# EAGLE design audiodaq_b (EAGLE 6.4)
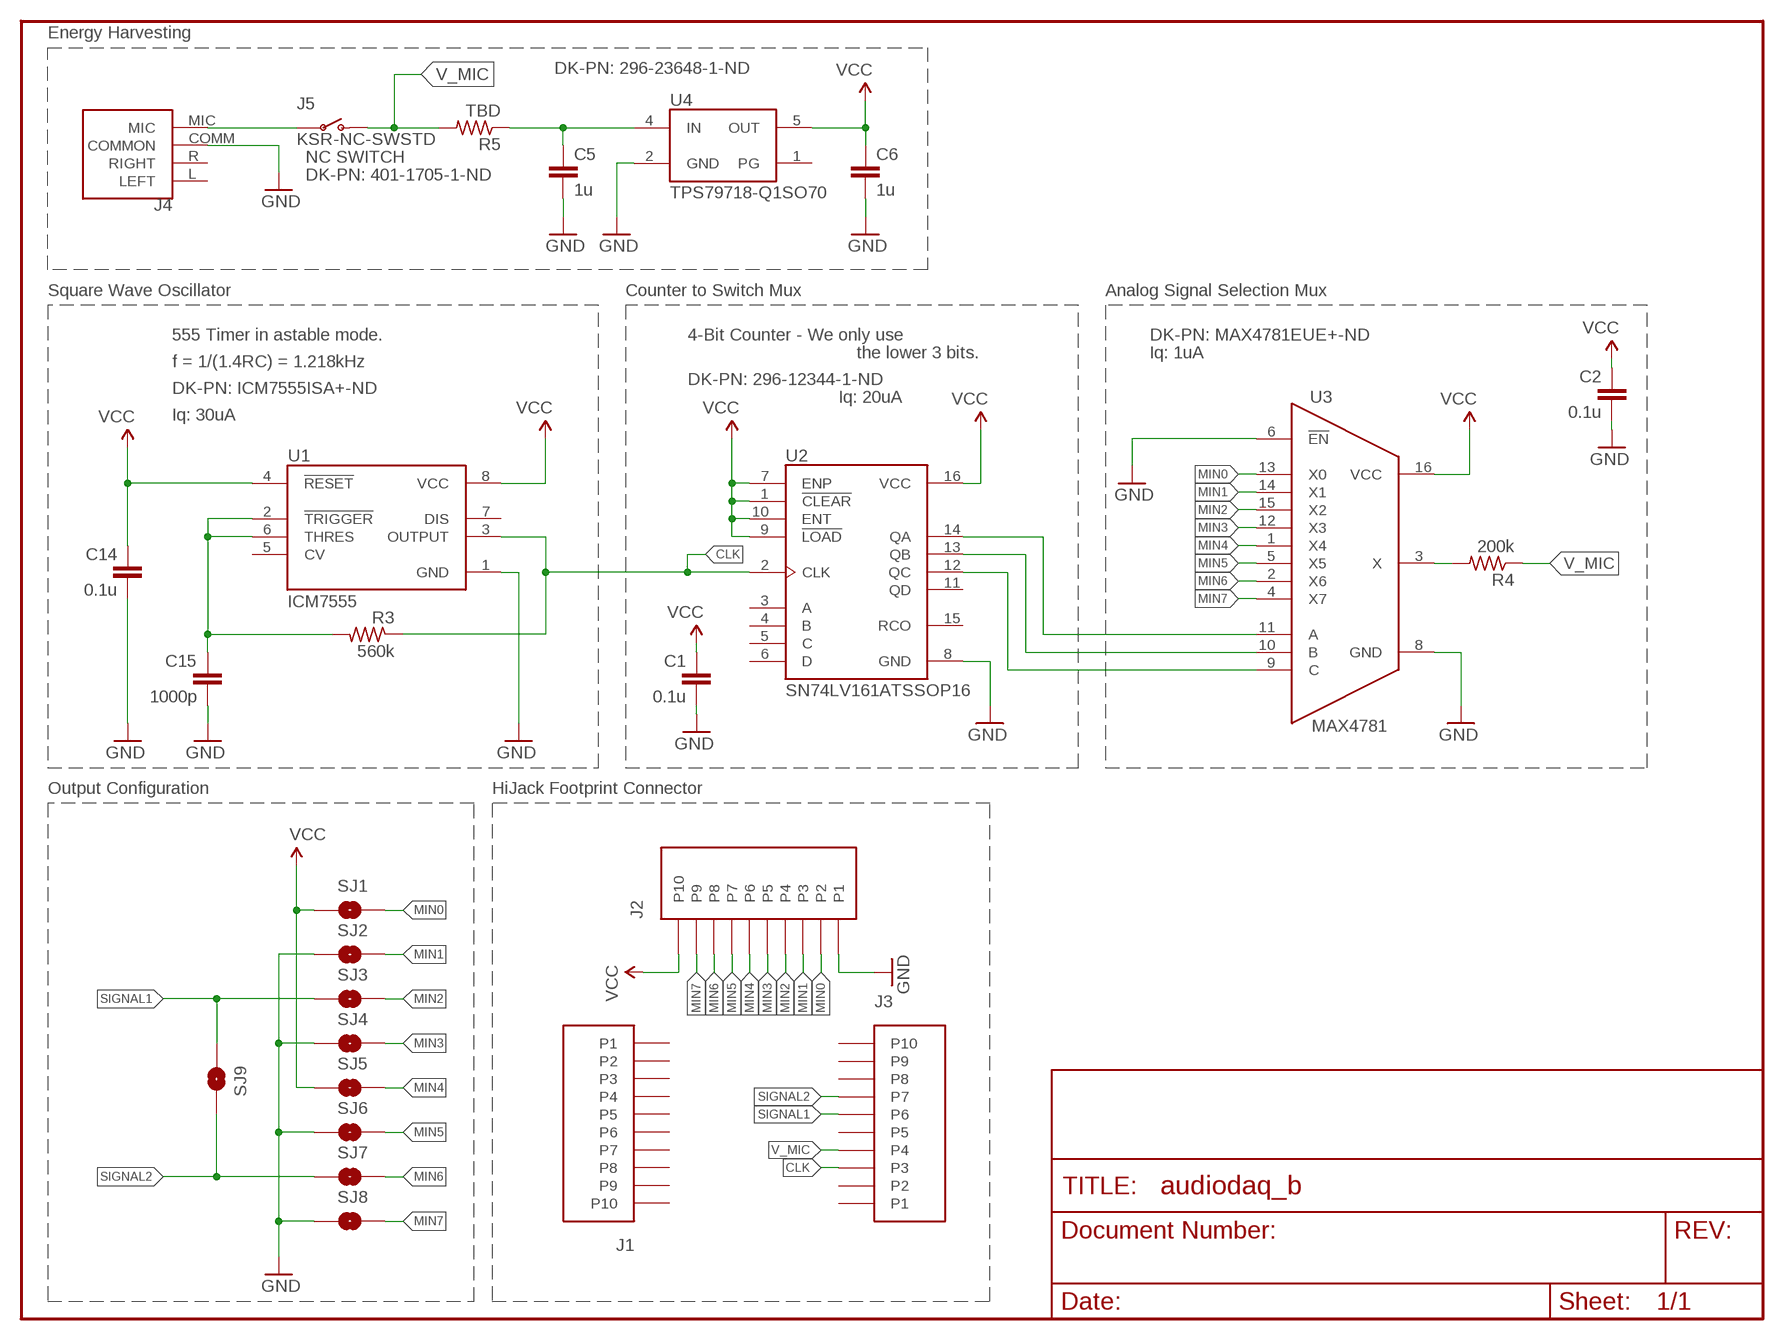
[diagram p0: schematic, sheet 1]

## Parts
C1  0.1u  C-EUC0603  [C0603]
C2  0.1u  C-EUC0603  [C0603]
C5  1u  C-EUC0603  [C0603]
C6  1u  C-EUC0603  [C0603]
C14  0.1u  C-EUC0603  [C0603]
C15  1000p  C-EUC0603  [C0603]
J1  HEADER10POS  [10PIN2MMHEADER]
J2  HEADER10POS  [10PIN2MMHEADER]
J3  HEADER10POS  [10PIN2MMHEADER]
J4  3.5JACK4CONNSUNSTONE_QUICKTURN  [PLUGBOARDCONNECTOR_SUNSTONE]
J5  KSR-NC-SWSTD  [KSR_SWITCH]
R3  560k  R-US_R0603  [R0603]
R4  200k  R-US_R0603  [R0603]
R5  TBD  R-US_R0603  [R0603]
SJ1  SOLDERJUMPERNO  [SJ_2S-NO]
SJ2  SOLDERJUMPERNO  [SJ_2S-NO]
SJ3  SOLDERJUMPERNO  [SJ_2S-NO]
SJ4  SOLDERJUMPERNO  [SJ_2S-NO]
SJ5  SOLDERJUMPERNO  [SJ_2S-NO]
SJ6  SOLDERJUMPERNO  [SJ_2S-NO]
SJ7  SOLDERJUMPERNO  [SJ_2S-NO]
SJ8  SOLDERJUMPERNO  [SJ_2S-NO]
SJ9  SOLDERJUMPERNO  [SJ_2S-NO]
U1  ICM7555  [SOIC]
U2  SN74LV161ATSSOP16  [TSSOP16]
U3  MAX4781  [TSSOP-16]
U4  TPS79718-Q1SO70  [SC70]

## Nets
CLK: J3.P3 R3.1 U1.3(OUTPUT) U2.2(CLK)
GND: C1.2 C2.2 C5.2 C6.2 C14.2 C15.2 J2.P1 J4.COMM(COMMON) SJ2.2 SJ4.2 SJ6.2 SJ8.2 U1.1(GND) U2.8(GND) U3.6(!EN) U3.8(GND) U4.2(GND)
MIN0: J2.P2 SJ1.1 U3.13(X0)
MIN1: J2.P3 SJ2.1 U3.14(X1)
MIN2: J2.P4 SJ3.1 U3.15(X2)
MIN3: J2.P5 SJ4.1 U3.12(X3)
MIN4: J2.P6 SJ5.1 U3.1(X4)
MIN5: J2.P7 SJ6.1 U3.5(X5)
MIN6: J2.P8 SJ7.1 U3.2(X6)
MIN7: J2.P9 SJ8.1 U3.4(X7)
N$2: U2.14(QA) U3.11(A)
N$3: U2.13(QB) U3.10(B)
N$4: C15.1 R3.2 U1.2(!TRIGGER) U1.6(THRES)
N$6: U2.12(QC) U3.9(C)
N$7: R4.2 U3.3(X)
N$9: C5.1 R5.1 U4.4(IN)
N$10: J4.MIC J5.P$2(P)
SIGNAL1: J3.P6 SJ3.2 SJ9.2
SIGNAL2: J3.P7 SJ7.2 SJ9.1
V_MIC: J3.P4 J5.P$1(O) R4.1 R5.2
VCC: C1.1 C2.1 C6.1 C14.1 J2.P10 SJ1.2 SJ5.2 U1.4(!RESET) U1.8(VCC) U2.1(!CLEAR) U2.7(ENP) U2.9(!LOAD) U2.10(ENT) U2.16(VCC) U3.16(VCC) U4.5(OUT)
Unconnected: J1.P1 J1.P2 J1.P3 J1.P4 J1.P5 J1.P6 J1.P7 J1.P8 J1.P9 J1.P10 J3.P1 J3.P2 J3.P5 J3.P8 J3.P9 J3.P10 J4.L(LEFT) J4.R(RIGHT) U1.5(CV) U1.7(DIS) U2.3(A) U2.4(B) U2.5(C) U2.6(D) U2.11(QD) U2.15(RCO) U4.1(PG)

## Notes on the sheet
- Energy Harvesting
- DK-PN: 296-23648-1-ND
- NC SWITCH
- DK-PN: 401-1705-1-ND
- Square Wave Oscillator | Counter to Switch Mux | Analog Signal Selection Mux
- 555 Timer in astable mode. | 4-Bit Counter - We only use | DK-PN: MAX4781EUE+-ND
- the lower 3 bits. | Iq: 1uA
- f = 1/(1.4RC) = 1.218kHz
- DK-PN: 296-12344-1-ND
- DK-PN: ICM7555ISA+-ND
- Iq: 20uA
- Iq: 30uA
- Output Configuration | HiJack Footprint Connector

## Library data of the parts
C1 C2 C5 C6 C14 C15 = rcl:C-EU: CAPACITOR, European symbol
J1-J3 = hijack:HEADER10POS: Fits 3M 950510-6102-AR
J4 = Thomas:3.5JACK4CONN
J5 = androbin:KSR-NC-SW
R3-R5 = rcl:R-US_: RESISTOR, American symbol
SJ1-SJ9 = SparkFun:SOLDERJUMPER: Solder Jumper Standard SMD solder jumper. Used to automate production. Two varients : Normally Open and Normally Closed are the same, but have different paste layers. NC will have a large amount of paste and should jumper during reflow.
U1 = androbin:ICM7555
U2 = androbin:SN74LV161A
U3 = androbin:MAX4781
U4 = androbin:TPS79718-Q1

## Board
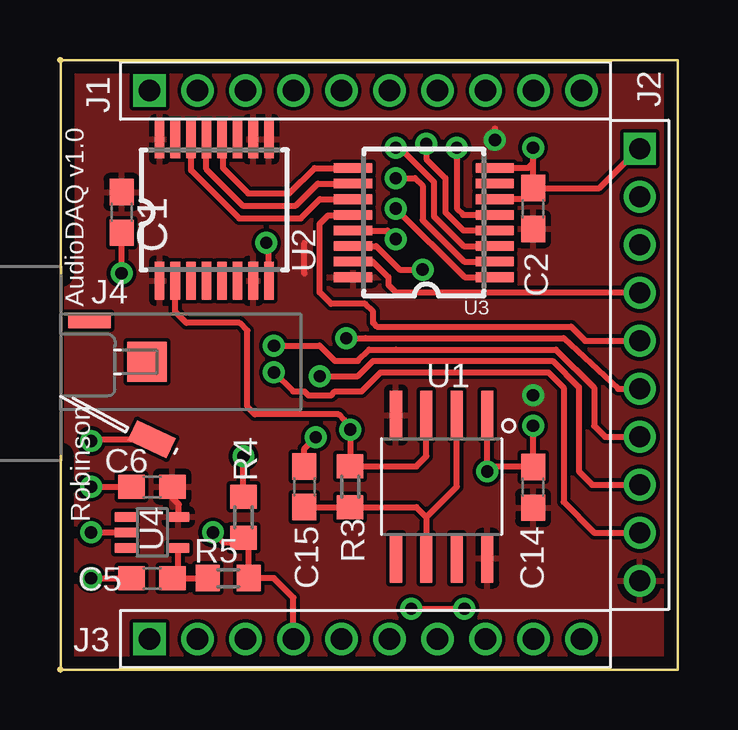
[diagram p1: board, top side]
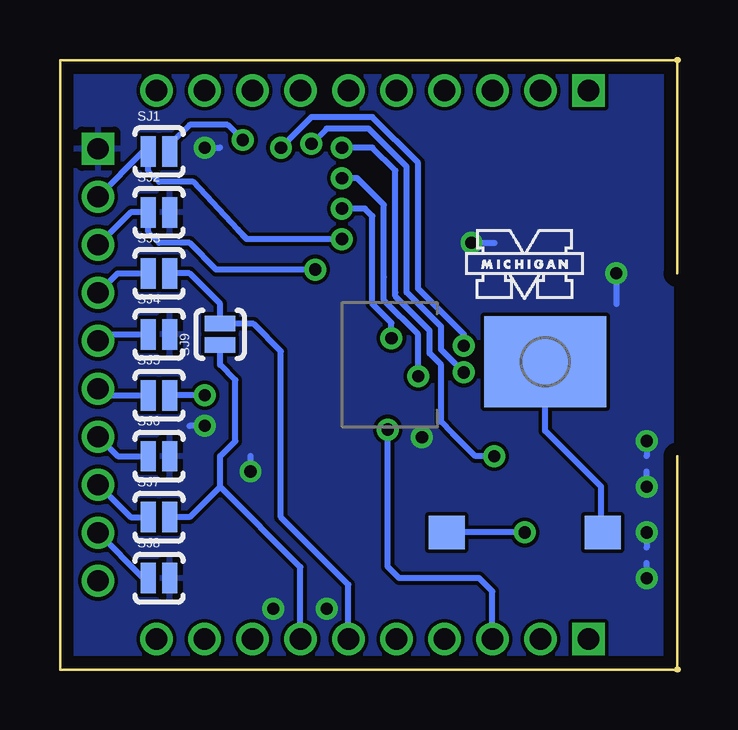
[diagram p2: board, bottom side, seen from below]

Size 25.74 x 25.4 mm. Coordinates in mm from the lower left corner, seen from the top.
Outline: 0,0 0.03,0
Outline: 0.03,0 25.74,0 25.74,25.4 0.03,25.4
Outline: 0.03,25.4 0,25.4
Outline: 0.03,25.4 0.03,16.51
Outline: 0.03,0 0.03,8.89
Copper layers (1*16): Top 0.0178mm / dielectric 1.4986mm / Bottom 0.0178mm
Design rules "SSC-EAGLE-2Lyr_v1.0.0.3 *": minimum track width 6mil, minimum drill 14mil, track to track 6mil, track to pad 6mil, pad to pad 6mil, via to via 6mil, smd to smd 6mil, copper to edge 20mil, drill to drill 16mil, minimum pad ring 8mil, minimum via ring 8mil, stop-mask expansion 3mil, vias tented up to drill 20mil, thermal gap 10mil

### Footprints (pad centres in the part's own frame; a part is rotated, then mirrored left to right if it is on the bottom)
C0603 = smd 1.1 x 1: 1 -0.85,0; 2 0.85,0
10PIN2MMHEADER = drill 0.89 pad 1.346 square: P1 -9,0 | drill 0.89 pad 1.346 round: P2 -7,0; P3 -5,0; P4 -3,0; P5 -1,0; P6 1,0; P7 3,0; P8 5,0; P9 7,0; P10 9,0
PLUGBOARDCONNECTOR_SUNSTONE = smd 1.778 x 0.914 rotated 155: COMM 3.799,-3.103 | smd 1.651 x 1.651: L 3.601,0.127 | smd 5.08 x 3.81 bottom: MIC 5.501,0.127 | smd 1.778 x 0.635: R 1.201,1.833
KSR_SWITCH = smd 1.5 x 1.4: P$1 -3.25,0; P$2 3.25,0
R0603 = smd 1 x 1.1: 1 -0.85,0; 2 0.85,0
SJ_2S-NO = smd 0.635 x 1.27: 1 -0.45,0; 2 0.45,0
SOIC = smd 0.51 x 2.032: 1 -1.905,-2.985; 2 -0.635,-2.985; 3 0.635,-2.985; 4 1.905,-2.985; 5 1.905,2.985; 6 0.635,2.985; 7 -0.635,2.985; 8 -1.905,2.985
TSSOP16 = smd 0.4 x 1.6: 1 -2.225,-2.85; 2 -1.575,-2.85; 3 -0.925,-2.85; 4 -0.275,-2.85; 5 0.375,-2.85; 6 1.025,-2.85; 7 1.675,-2.85; 8 2.325,-2.85; 9 2.325,3.05; 10 1.675,3.05; 11 1.025,3.05; 12 0.375,3.05; 13 -0.275,3.05; 14 -0.925,3.05; 15 -1.575,3.05; 16 -2.225,3.05
TSSOP-16 = smd 0.4 x 1.6: 1 -2.225,-2.85; 2 -1.575,-2.85; 3 -0.925,-2.85; 4 -0.275,-2.85; 5 0.375,-2.85; 6 1.025,-2.85; 7 1.675,-2.85; 8 2.325,-2.85; 9 2.325,3.05; 10 1.675,3.05; 11 1.025,3.05; 12 0.375,3.05; 13 -0.275,3.05; 14 -0.925,3.05; 15 -1.575,3.05; 16 -2.225,3.05
SC70 = smd 0.4 x 0.9: 1 -0.65,-1.1; 2 0,-1.1; 3 0.65,-1.1; 4 0.65,1.1; 5 -0.65,1.1

### Placement (x,y rotation side)
C1  2.57,19.05 270 top
C2  19.71,19.21 90 top
C5  3.84,3.81 180 top
C6  3.84,7.62 180 top
C14  19.71,7.59 90 top
C15  10.19,7.62 90 top
E$1  [UMICH]  8.92,15.24 0 bottom
J1  12.73,24.13 0 top
J2  24.16,12.7 270 top
J3  12.73,1.27 0 top
J4  0.03,12.7 0 top
J5  6.38,5.71 0 bottom
R3  12.09,7.62 270 top
R4  7.65,6.35 90 top
R5  7.01,3.81 0 top
SJ1  21.62,21.59 0 bottom
SJ2  21.62,19.05 0 bottom
SJ3  21.62,16.51 0 bottom
SJ4  21.62,13.97 0 bottom
SJ5  21.62,11.43 0 bottom
SJ6  21.62,8.89 0 bottom
SJ7  21.62,6.35 0 bottom
SJ8  21.62,3.81 0 bottom
SJ9  19.08,13.97 90 bottom
U1  15.9,7.62 180 top
U2  6.38,19.05 0 top
U3  15.27,18.57 90 top
U4  3.84,5.71 270 top

### Tracks (layer width: path | path; a pad name or v marks a point on that pad's centre or on a via)
CLK  (via drill 0.51)
  Top 0.254: U1.3 15.27,8.89 14.85,8.47 R3.1 v12.09,10 12.09,10.16 11.85,10.4 11.61,10.64 8.12,10.64 7.8,10.95 7.8,14.13 7.49,14.45 5.26,14.45 4.8,14.91 U2.2
  Bottom 0.254: J3.P3 7.73,3.25 8.28,3.81 11.61,3.81 12.09,4.29 v12.09,10
GND  (via drill 0.51)
  Top 0.254: v1.3,7.62 C6.2 | v1.3,5.71 U4.2 | v1.3,3.81 C5.2 | J4.COMM 1.37,9.6 v1.3,9.53 | v2.57,16.51 C1.2 | U1.1 v17.81,8.26 18,8.45 C14.2 v19.71,10.16 | C2.2 19.71,21.11 | 19.71,21.11 v19.71,21.75 | U3.8 19.5,20.9 19.71,21.11 | U3.6 19.25,19.6 C2.2 | C2.2 22.47,20.06 24.16,21.75 | v14.63,2.54 v16.85,2.54 | U2.8 8.7,17.68 v8.6,17.78 | C15.2 10.19,9.21 v10.66,9.68
  Bottom 0.254: v1.3,7.62 1.3,8.26 | v1.3,5.71 1.3,5.08 | v1.3,3.81 1.3,4.45 | v1.3,9.53 1.3,8.89 | v2.57,16.51 2.57,15.24 | v17.81,8.26 17.81,8.89 | v19.71,21.75 19.08,21.75 | v19.71,10.16 20.35,10.16 | v8.6,17.78 7.65,17.78 | v10.66,9.68 10.98,9.53
  pour Bottom: 0.3,25.07 25.83,25.07 25.83,0.33 0.25,0.33 0.25,25.04
MIN0  (via drill 0.51)
  Top 0.254: U3.13 13.64,18.29 v14,17.94
  Bottom 0.254: J2.P2 22.27,21.59 SJ1.1 22.07,20.77 21.62,20.32 20.19,20.32 18.33,18.34 | 18.33,18.34 17.96,17.94 | v14,17.94 17.94,17.94 18.33,18.34
MIN1  (via drill 0.51)
  Top 0.254: 12.23,17.66 U3.14 13.17,17.65 14.15,16.67 v15.11,16.67
  Bottom 0.254: J2.P3 22.81,19.05 SJ2.1 22.07,18.23 21.62,17.78 20.35,17.78 19.23,16.67 v15.11,16.67
MIN2
  Top 0.254: U3.15 13.03,17 13.68,16.35 13.68,16.03 14,15.72 24.14,15.72 J2.P4
  Bottom 0.254: SJ3.1 23.35,16.51 J2.P4
MIN3
  Top 0.254: J2.P5 21.89,13.7 21.3,14.29 13.2,14.29 13.04,14.45 13.04,14.92 12.73,15.24 11.3,15.24 10.82,15.72 10.82,18.57 11.18,18.93 12.2,18.93 U3.12
  Bottom 0.254: SJ4.1 23.89,13.97 J2.P5
MIN4  (via drill 0.51)
  Top 0.254: J2.P6 23.25,11.7 20.98,13.81 12.73,13.81 v11.93,13.81 | U3.1 16.86,16.35 v14,19.21
  Bottom 0.254: SJ5.1 23.89,11.43 J2.P6 | v14,19.21 13.04,19.21 12.73,18.89 12.73,15.24 11.93,14.45 v11.93,13.81
MIN5  (via drill 0.51)
  Top 0.254: J2.P7 22.71,9.7 22.25,10.16 22.25,11.75 20.66,13.34 14,13.34 | U3.5 16.8,18.95 16.54,19.21 v16.54,21.75 | 14,13.34 | 14,13.34 12.88,13.34 12.41,12.86 11.46,12.86 10.82,13.49 v8.92,13.49
  Bottom 0.254: SJ6.1 23.35,8.89 J2.P7 | v16.54,21.75 15.27,23.02 12.73,23.02 10.82,21.11 10.82,15.88 8.92,13.97 v8.92,13.49
MIN6  (via drill 0.51)
  Top 0.254: J2.P8 22.17,7.7 21.62,8.26 21.62,11.77 20.53,12.86 13.04,12.86 12.41,12.22 v10.82,12.22 | 16.84,17 U3.2 | 16.84,17 | 16.84,17 15.11,18.73 15.11,20.16 14.79,20.48 v14,20.48
  Bottom 0.254: SJ7.1 22.81,6.35 J2.P8 | v14,20.48 13.36,20.48 12.25,19.37 12.25,16.35 12.25,15.4 | 12.25,15.4 | 12.25,15.4 10.82,13.97 v10.82,12.22
MIN7  (via drill 0.51)
  Top 0.254: J2.P9 22.27,5.7 20.98,6.99 20.98,11.75 20.35,12.38 13.36,12.38 12.57,11.59 11.46,11.59 11.3,11.43 10.34,11.43 10.19,11.59 9.71,11.59 v8.92,12.38 | U3.4 16.81,18.3 16.06,19.05 16.06,20.48 15.27,21.27 v15.27,21.91
  Bottom 0.254: SJ8.1 22.27,3.81 J2.P9 | v15.27,21.91 14.63,22.54 12.88,22.54 11.3,20.95 11.3,15.72 9.87,14.29 9.87,13.34 v8.92,12.38
N$2
  Top 0.254: U3.11 10.83,19.6 10.03,18.8 7.46,18.8 5.46,20.8 5.46,22.09 U2.14
N$3
  Top 0.254: U3.10 10.74,20.25 9.83,19.34 7.61,19.34 6.1,20.85 U2.13
N$4
  Top 0.254: C15.1 R3.2 14.85,6.77 15.27,6.35 | 15.27,6.35 U1.6 | U1.2 16.54,7.62 15.27,6.35
N$6
  Top 0.254: U3.9 10.61,20.9 9.55,19.84 7.84,19.84 6.78,20.9 6.78,22.07 U2.12
N$7  (via drill 0.51)
  Top 0.254: U3.3 16.83,17.65 15.58,18.89 15.58,20.32 14.15,21.75 v14,21.75 | R4.2 v7.65,8.89
  Bottom 0.254: v14,21.75 12.73,21.75 11.77,20.8 11.77,15.72 11.77,15.56 10.34,14.13 10.34,13.18 9.87,12.7 9.87,10.32 9.39,9.84 | 9.39,9.84 | 8.6,9.05 9.39,9.84 | 8.6,9.05 | 8.6,9.05 8.44,8.89 v7.65,8.89
N$9
  Top 0.254: U4.4 4.94,4.06 C5.1 R5.1
N$10
  Bottom 0.254: J4.MIC 5.53,9.95 3.2,7.62 3.2,5.79 J5.P$2
SIGNAL1
  Bottom 0.254: SJ3.2 20.35,16.51 19.08,15.24 SJ9.2 19.06,14.4 17.68,14.4 16.54,13.26 16.54,6.35 13.73,3.54 J3.P6
SIGNAL2
  Bottom 0.254: SJ7.2 20.35,6.35 19.08,7.62 | J3.P7 15.73,4.27 19.08,7.62 | SJ9.1 19.08,12.7 18.44,12.06 18.44,9.53 19.08,8.89 19.08,7.62
V_MIC  (via drill 0.51)
  Top 0.254: 7.86,5.29 R5.2 8.92,3.81 9.73,3 J3.P4 | 7.86,5.29 R4.1 | 7.86,5.29 6.81,5.29 v6.38,5.71
  Bottom 0.254: v6.38,5.71 J5.P$1
VCC  (via drill 0.51)
  Top 0.254: C6.1 4.69,7.15 4.95,6.88 4.95,6.38 U4.5 | 10.19,16.51 10.19,17.78 | v18.12,22.07 18.12,22.54
  Bottom 0.254: v19.71,11.43 SJ5.2 | SJ1.2 21.17,21.88 20.35,22.7 18.76,22.7 v18.12,22.07
  pour Top: 0.3,25.04 25.86,25.04 25.86,0.28 0.28,0.28 0.28,25.02

### Text on the board
tPlace: AudioDAQ v1.0 | Robinson